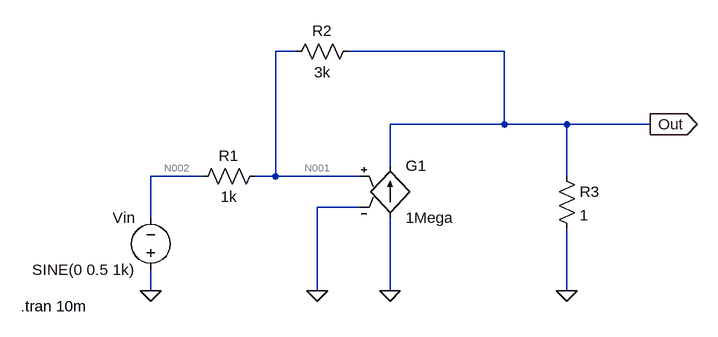
[diagram p0: schematic Q3.asc]
Q3.asc, the LTspice schematic file:
Version 4
SHEET 1 880 680
WIRE 208 -96 176 -96
WIRE 528 -96 288 -96
WIRE 528 16 528 -96
WIRE 528 16 352 16
WIRE 624 16 528 16
WIRE 752 16 624 16
WIRE 352 80 352 16
WIRE 64 96 -16 96
WIRE 176 96 176 -96
WIRE 176 96 144 96
WIRE 304 96 176 96
WIRE 624 96 624 16
WIRE 304 144 240 144
WIRE -16 160 -16 96
WIRE -16 272 -16 240
WIRE 240 272 240 144
WIRE 352 272 352 160
WIRE 624 272 624 176
FLAG -16 272 0
FLAG 240 272 0
FLAG 352 272 0
FLAG 624 272 0
FLAG 752 16 Out
IOPIN 752 16 Out
SYMBOL voltage -16 256 R180
WINDOW 0 24 96 Left 2
WINDOW 3 24 16 Left 2
WINDOW 123 0 0 Left 0
WINDOW 39 0 0 Left 0
SYMATTR InstName Vin
SYMATTR Value SINE(0 0.5 1k)
SYMBOL res 160 80 R90
WINDOW 0 0 56 VBottom 2
WINDOW 3 32 56 VTop 2
SYMATTR InstName R1
SYMATTR Value 1k
SYMBOL g 352 64 R0
SYMATTR InstName G1
SYMATTR Value 1Mega
SYMBOL res 304 -112 R90
WINDOW 0 0 56 VBottom 2
WINDOW 3 32 56 VTop 2
SYMATTR InstName R2
SYMATTR Value 3k
SYMBOL res 608 80 R0
SYMATTR InstName R3
SYMATTR Value 1
TEXT -216 296 Left 2 !.tran 10m

The netlist it stands for:
* Q3.asc
Vin 0 N002 SINE(0 0.5 1k)
R1 N001 N002 1k
G1 0 Out N001 0 1Mega
R2 Out N001 3k
R3 Out 0 1
.tran 10m
.backanno
.end

* Results of the author's LTspice run, read from the files saved beside the schematic
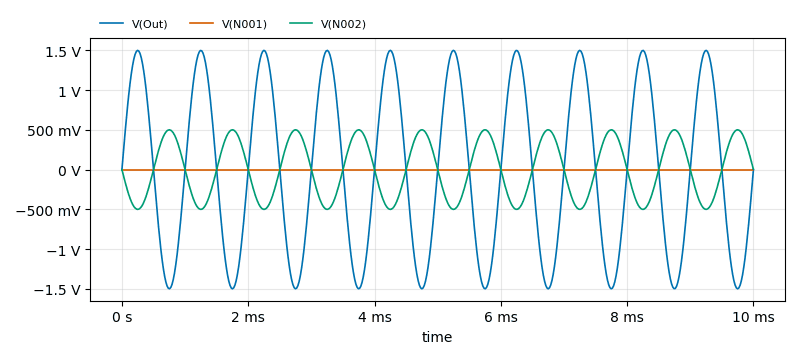
[diagram p1: Transient Analysis of Q3.asc, plotted from the saved traces]
* Transient Analysis, 1 run:
*   V(Out): min -1.499 V, max 1.499 V, average 0 V, rms 1.06 V, last 0 V
*   V(N001): min -1.499 µV, max 1.499 µV, average 0 V, rms 1.06 µV, last 0 V
*   V(N002): min -500 mV, max 500 mV, average 0 V, rms 353.6 mV, last 0 V